# Altium schematic sheet Perifericos.SchDoc: External Plugs
size A; DrawnBy: Castro Germán; Revision: R00; SheetNumber: 3; SheetTotal: 3
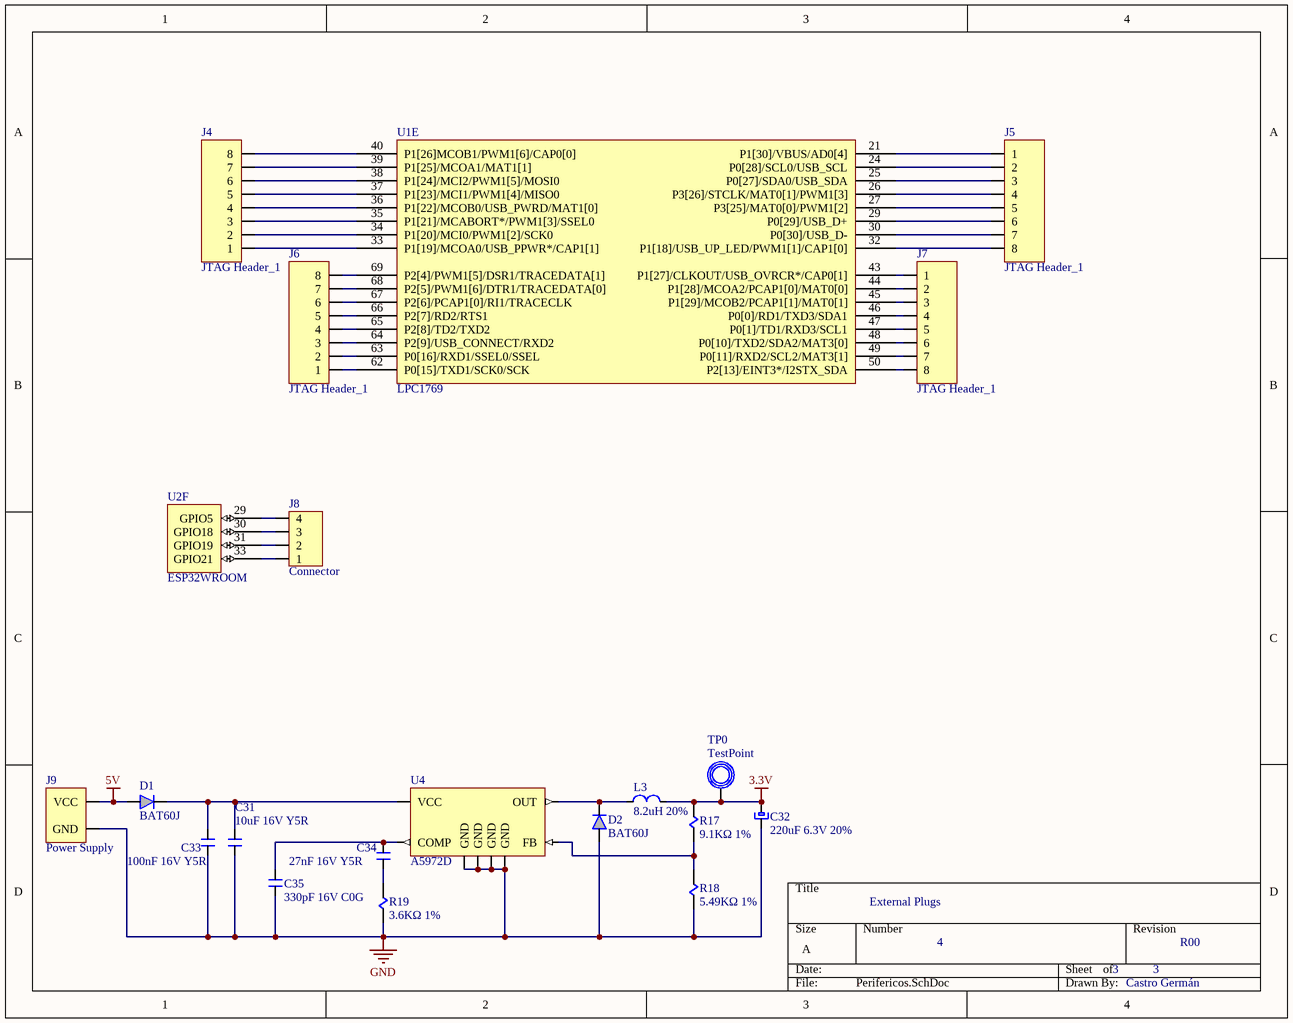
[diagram p0: Perifericos.SchDoc]

## Parts
C31  10uF 16V Y5R  [C_0805]
C32  220uF 6.3V 20%  [CT_2917_D]
C33  100nF 16V Y5R  [C_0805]
C34  27nF 16V Y5R  [C_0805]
C35  330pF 16V C0G  [C_0805]
D1  BAT60J  [SOD323]
D2  BAT60J  [SOD323]
J4  JTAG Header_1  [HDRM_2.54mm_1X8]
J5  JTAG Header_1  [HDRM_2.54mm_1X8]
J6  JTAG Header_1  [HDRM_2.54mm_1X8]
J7  JTAG Header_1  [HDRM_2.54mm_1X8]
J8  Connector  [HDRM_0.1_1X4]
J9  Power Supply  [HDRM_0.1_1x2]
L3  8.2uH 20%  [1R5_1710]
R17  9.1KΩ 1%  [R_0805]
R18  5.49KΩ 1%  [R_0805]
R19  3.6KΩ 1%  [R_0805]
TP0  TestPoint  [TestPoint]
U1  LPC1769  [LQFP100]  (part E of 5)
U2  ESP32WROOM  [ESP32_WROOM - duplicate]  (part F of 6)
U4  A5972D  [SO_8]

## Nets
3.3V: C32.1(P) L3.2(P2) R17.2(P2) TP0.1
5V: D1.1(A) J9.1(VCC)
GND: C31.2(A2) C32.2(N) C33.2(A2) C35.2(A2) D2.1(A) J9.2(GND) R18.1(P1) R19.1(P1) U4.2(GND) U4.3(GND) U4.6(GND) U4.7(GND)
NetC31_1: C31.1(A1) C33.1(A1) D1.2(K) U4.8(VCC)
NetC34_1: C34.1(A1) C35.1(A1) U4.4(COMP)
NetC34_2: C34.2(A2) R19.2(P2)
NetD2_2: D2.2(K) L3.1(P1) U4.1(OUT)
NetJ4_1: J4.1 U1.33(P1[19]/MCOA0/USB_PPWR*/CAP1[1])
NetJ4_2: J4.2 U1.34(P1[20]/MCI0/PWM1[2]/SCK0)
NetJ4_3: J4.3 U1.35(P1[21]/MCABORT*/PWM1[3]/SSEL0)
NetJ4_4: J4.4 U1.36(P1[22]/MCOB0/USB_PWRD/MAT1[0])
NetJ4_5: J4.5 U1.37(P1[23]/MCI1/PWM1[4]/MISO0)
NetJ4_6: J4.6 U1.38(P1[24]/MCI2/PWM1[5]/MOSI0)
NetJ4_7: J4.7 U1.39(P1[25]/MCOA1/MAT1[1])
NetJ4_8: J4.8 U1.40(P1[26]MCOB1/PWM1[6]/CAP0[0])
NetJ5_1: J5.1 U1.21(P1[30]/VBUS/AD0[4])
NetJ5_2: J5.2 U1.24(P0[28]/SCL0/USB_SCL)
NetJ5_3: J5.3 U1.25(P0[27]/SDA0/USB_SDA)
NetJ5_4: J5.4 U1.26(P3[26]/STCLK/MAT0[1]/PWM1[3])
NetJ5_5: J5.5 U1.27(P3[25]/MAT0[0]/PWM1[2])
NetJ5_6: J5.6 U1.29(P0[29]/USB_D+)
NetJ5_7: J5.7 U1.30(P0[30]/USB_D-)
NetJ5_8: J5.8 U1.32(P1[18]/USB_UP_LED/PWM1[1]/CAP1[0])
NetJ6_1: J6.1 U1.62(P0[15]/TXD1/SCK0/SCK)
NetJ6_2: J6.2 U1.63(P0[16]/RXD1/SSEL0/SSEL)
NetJ6_3: J6.3 U1.64(P2[9]/USB_CONNECT/RXD2)
NetJ6_4: J6.4 U1.65(P2[8]/TD2/TXD2)
NetJ6_5: J6.5 U1.66(P2[7]/RD2/RTS1)
NetJ6_6: J6.6 U1.67(P2[6]/PCAP1[0]/RI1/TRACECLK)
NetJ6_7: J6.7 U1.68(P2[5]/PWM1[6]/DTR1/TRACEDATA[0])
NetJ6_8: J6.8 U1.69(P2[4]/PWM1[5]/DSR1/TRACEDATA[1])
NetJ7_1: J7.1 U1.43(P1[27]/CLKOUT/USB_OVRCR*/CAP0[1])
NetJ7_2: J7.2 U1.44(P1[28]/MCOA2/PCAP1[0]/MAT0[0])
NetJ7_3: J7.3 U1.45(P1[29]/MCOB2/PCAP1[1]/MAT0[1])
NetJ7_4: J7.4 U1.46(P0[0]/RD1/TXD3/SDA1)
NetJ7_5: J7.5 U1.47(P0[1]/TD1/RXD3/SCL1)
NetJ7_6: J7.6 U1.48(P0[10]/TXD2/SDA2/MAT3[0])
NetJ7_7: J7.7 U1.49(P0[11]/RXD2/SCL2/MAT3[1])
NetJ7_8: J7.8 U1.50(P2[13]/EINT3*/I2STX_SDA)
NetJ8_1: J8.1 U2.33(GPIO21)
NetJ8_2: J8.2 U2.31(GPIO19)
NetJ8_3: J8.3 U2.30(GPIO18)
NetJ8_4: J8.4 U2.29(GPIO5)
NetR17_1: R17.1(P1) R18.2(P2) U4.5(FB)

## Notes on the sheet
- 4

## Library data of the parts
C31 C33-C35 = Capacitor
C32 = Polarized Capacitor
D1 D2 = Diode: Generic Diode
J4-J7 = Connector1x8
J8 = Connectorx4
J9 = Power Connector
L3 = Inductor
R17-R19 = Resistor
U1 = LPC1769: 32 bit ARM Cortex M3
U4 = A5972D: Fuente Switching 3.3v 1.5A